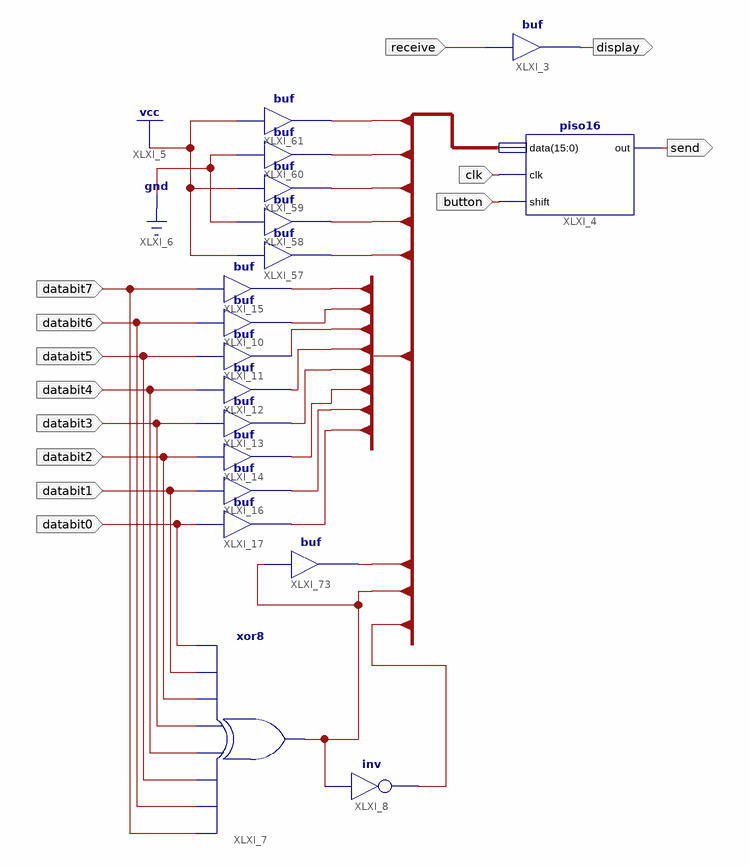
[diagram p0: schematic sheet 1]
// Xilinx ISE schematic top.sch (spartan6) as structural Verilog: 18 symbols, 13 ports
module top (
  input  databit7,
  input  databit6,
  input  databit5,
  input  databit4,
  input  databit3,
  input  databit2,
  input  databit1,
  input  databit0,
  input  receive,
  input  button,
  input  clk,
  output display,
  output send
);

  wire [15:0] data;

  buf XLXI_17 (data[3], databit0);
  buf XLXI_16 (data[4], databit1);
  buf XLXI_14 (data[5], databit2);
  buf XLXI_13 (data[6], databit3);
  buf XLXI_12 (data[7], databit4);
  buf XLXI_11 (data[8], databit5);
  buf XLXI_10 (data[9], databit6);
  buf XLXI_15 (data[10], databit7);
  buf XLXI_3 (display, receive);
  buf XLXI_57 (data[11], 1'b1);
  buf XLXI_58 (data[12], 1'b0);
  buf XLXI_59 (data[13], 1'b1);
  buf XLXI_60 (data[14], 1'b0);
  buf XLXI_61 (data[15], 1'b1);
  buf XLXI_73 (data[2], data[1]);
  not XLXI_8 (data[0], data[1]);
  xor XLXI_7 (data[1], databit7, databit6, databit5, databit4, databit3, databit2, databit1, databit0);
  piso16 XLXI_4 (.data(data), .clk(clk), .shift(button), .out(send));
endmodule
